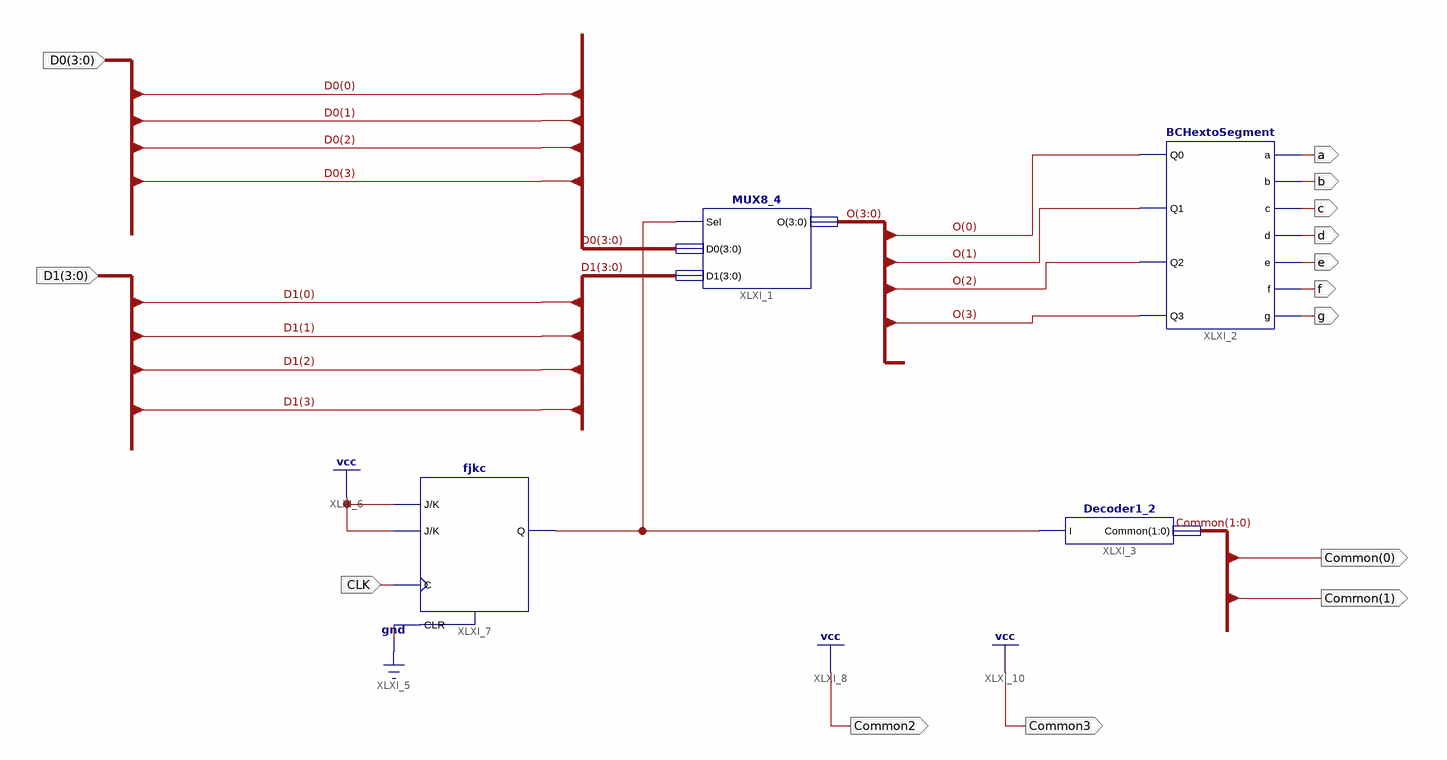
[diagram p0: schematic sheet 1]
// Xilinx ISE schematic Display.sch (spartan6) as structural Verilog: 4 symbols, 14 ports
module Display (
  input  [3:0] D1,
  input  [3:0] D0,
  input  CLK,
  output [1:0] Common,
  output a,
  output b,
  output c,
  output d,
  output e,
  output f,
  output g,
  output Common2,
  output Common3
);

  wire XLXN_5;
  wire [3:0] O;

  MUX8_4 XLXI_1 (.Sel(XLXN_5), .D0(D0), .D1(D1), .O(O));
  BCHextoSegment XLXI_2 (.Q0(O[0]), .Q1(O[1]), .Q2(O[2]), .Q3(O[3]), .a(a), .b(b), .c(c), .d(d), .e(e), .f(f), .g(g));
  Decoder1_2 XLXI_3 (.I(XLXN_5), .Common(Common));
  fjkc XLXI_7 (.C(CLK), .CLR(1'b0), .J(1'b1), .K(1'b1), .Q(XLXN_5));

  assign Common2 = 1'b1;
  assign Common3 = 1'b1;
endmodule
